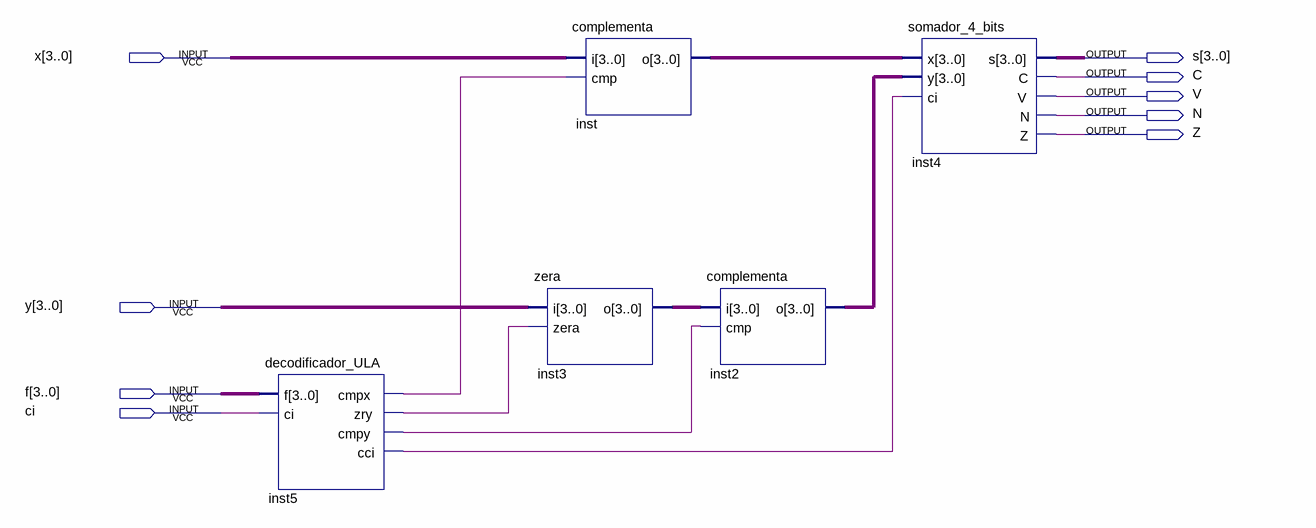
[diagram p0: schematic sheet]
// Quartus schematic ULA.bdf as structural Verilog: 5 symbols, 9 pins
module ULA (
  input  [3:0] x,
  input  [3:0] y,
  input  [3:0] f,
  input  ci,
  output [3:0] s,
  output C,
  output V,
  output N,
  output Z
);

  wire inst5_cci, inst5_cmpx, inst5_cmpy, inst5_zry;
  wire [3:0] inst2_o, inst3_o, inst_o;

  decodificador_ULA inst5 (.f(f), .ci(ci), .cmpx(inst5_cmpx), .cmpy(inst5_cmpy), .zry(inst5_zry), .cci(inst5_cci));
  complementa inst (.i(x), .cmp(inst5_cmpx), .o(inst_o));
  zera inst3 (.i(y), .zera(inst5_zry), .o(inst3_o));
  complementa inst2 (.i(inst3_o), .cmp(inst5_cmpy), .o(inst2_o));
  somador_4_bits inst4 (.x(inst_o), .y(inst2_o), .ci(inst5_cci), .V(V), .C(C), .s(s), .N(N), .Z(Z));
endmodule
